# EAGLE design Sensorino (EAGLE 9.6.2)
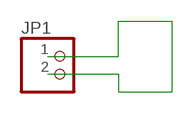
[diagram p0: schematic, sheet 1]

## Parts
JP1  PINHD-1X2  [1X02]

## Nets
N$2: JP1.1 JP1.2

## Library data of the parts
JP1 = pinhead:PINHD-1X2: PIN HEADER

## Board
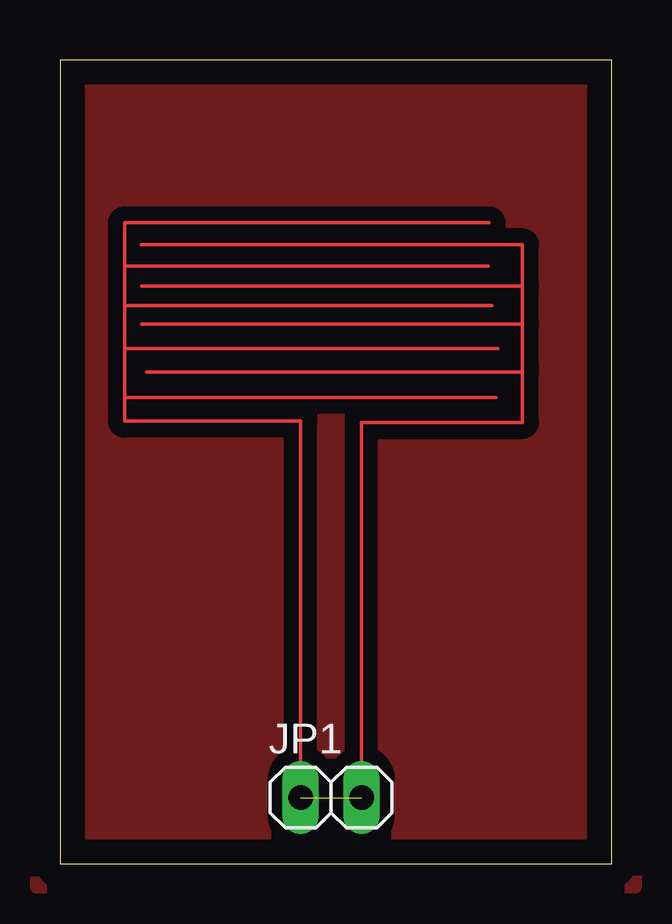
[diagram p1: board, top side]
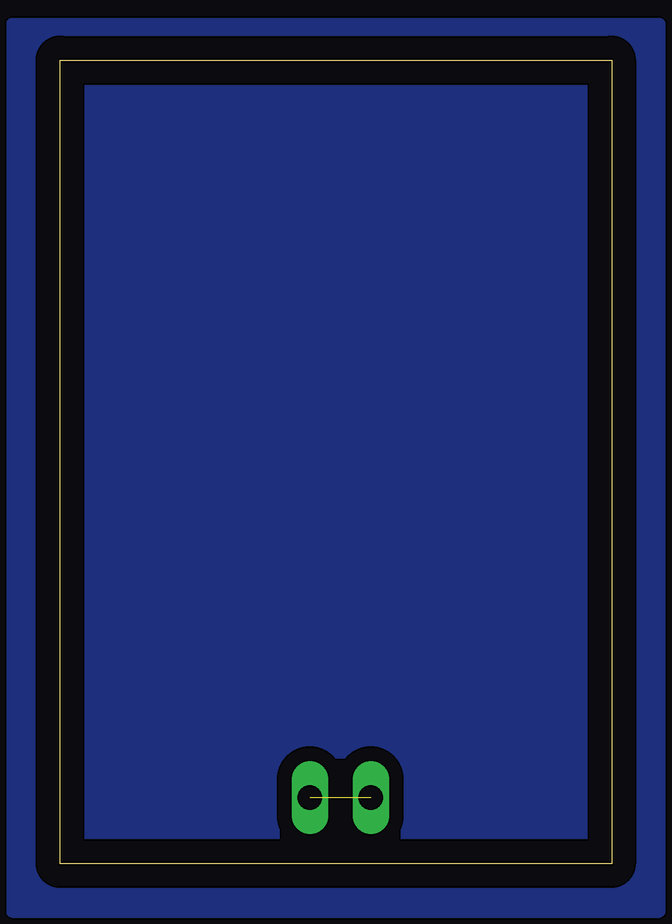
[diagram p2: board, bottom side, seen from below]

Size 23 x 33.5 mm. Coordinates in mm from the lower left corner, seen from the top.
Outline: 0,0 23,0 23,33.5 0,33.5 0,0
Copper layers (1*16): Top 0.035mm / dielectric 1.5mm / Bottom 0.035mm
Design rules "default": minimum track width 6mil, minimum drill 0.35mm, track to track 6mil, track to pad 6mil, pad to pad 6mil, via to via 6mil, smd to smd 6mil, copper to edge 40mil, drill to drill 6mil, minimum pad ring 10mil, minimum via ring 8mil, stop-mask expansion 4mil, vias tented up to drill 0mil, thermal gap 10mil

### Footprints (pad centres in the part's own frame; a part is rotated, then mirrored left to right if it is on the bottom)
1X02 = drill 1.016 long: 1 -1.27,0; 2 1.27,0

### Placement (x,y rotation side)
JP1  11.31,2.75 0 top

### Tracks (layer width: path | path; a pad name or v marks a point on that pad's centre or on a via)
GND
  pour Bottom (isolate 0.61): -2,35 25,35 25,-2 -2,-2
N$2  (1 unrouted)
  Top 0.152: JP1.1 10.04,18.44 2.69,18.44 2.69,19.43 | 18.18,19.43 2.69,19.43 | 2.69,19.43 2.69,21.47 | 2.69,21.47 18.26,21.47 | 18.02,23.27 2.69,23.27 | 17.86,24.9 2.69,24.9 | 2.69,21.47 2.69,23.27 | 2.69,23.27 2.69,24.9 | 2.69,24.9 2.69,26.71 17.89,26.71 | JP1.2 12.58,18.39 19.29,18.39 19.29,20.71 | 3.62,20.48 19.29,20.48 19.29,22.48 | 3.4,22.48 19.29,22.48 | 19.29,22.48 19.29,24.08 3.4,24.08 | 19.29,24.04 19.29,25.8 3.39,25.8
TOPSIGNAL
  pour Top (isolate 0.61): -1,34 24,34 24,-1 -1,-1